# EAGLE design manuellsteuerung (EAGLE 6.4)
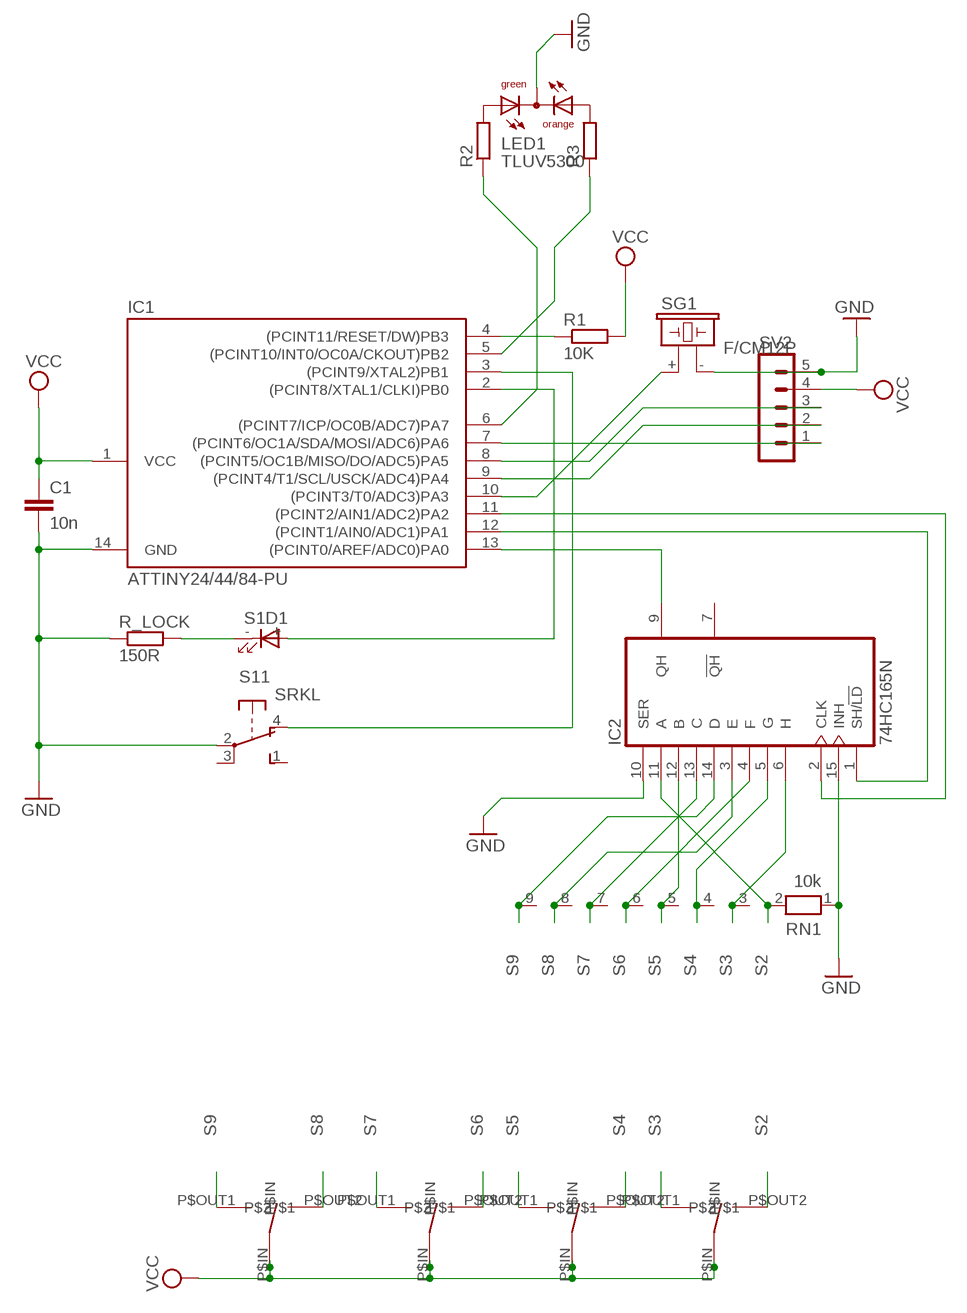
[diagram p0: schematic, sheet 1]

## Parts
C1  10n  C-EU025-024X044  [C025-024X044]
IC1  ATTINY24/44/84-PU  [DIL14]
IC2  74HC165N  [DIL16]
LED1  TLUV5300  [TLUV5300]
R1  10K  R-EU_0207/7  [0207/7]
R2  R-EU_0207/7  [0207/7]
R3  R-EU_0207/7  [0207/7]
R_LOCK  150R  R-EU_0207/10  [0207/10]
RN1  10k  RN08  [RN-9]
S1  SRKL  [SRKL]
SG1  F/CM12P  [F/CM12P]
SV2  MA05-1  [MA05-1]
U$1  MS_500E  [MS_500E]
U$2  MS_500E  [MS_500E]
U$3  MS_500E  [MS_500E]
U$4  MS_500E  [MS_500E]

## Nets
GND: C1.2 IC1.14(GND) IC2.10(SER) IC2.15(INH) LED1.CC R_LOCK.1 RN1.1 S1.2(1:P) SG1.- SV2.5
MISO: IC1.8((PCINT5/OC1B/MISO/DO/ADC5)PA5) SV2.3
MOSI: IC1.7((PCINT6/OC1A/SDA/MOSI/ADC6)PA6) SV2.1
N$1: IC1.13((PCINT0/AREF/ADC0)PA0) IC2.9(QH)
N$2: IC1.12((PCINT1/AIN0/ADC1)PA1) IC2.1(SH/!LD)
N$3: IC1.11((PCINT2/AIN1/ADC2)PA2) IC2.2(CLK)
N$4: R_LOCK.2 S1.-(D1:C)
N$5: IC1.2((PCINT8/XTAL1/CLKI)PB0) S1.+(D1:A)
N$6: IC1.3((PCINT9/XTAL2)PB1) S1.4(1:O)
N$7: IC1.10((PCINT3/T0/ADC3)PA3) SG1.+
N$11: LED1.AG R2.2
N$12: LED1.AO R3.2
N$13: IC1.6((PCINT7/ICP/OC0B/ADC7)PA7) R2.1
N$14: IC1.5((PCINT10/INT0/OC0A/CKOUT)PB2) R3.1
RESET: IC1.4((PCINT11/RESET/DW)PB3) R1.1
S2: IC2.11(A) RN1.2 U$4.P$OUT2
S3: IC2.6(H) RN1.3 U$4.P$OUT1
S4: IC2.5(G) RN1.4 U$1.P$OUT2
S5: IC2.12(B) RN1.5 U$1.P$OUT1
S6: IC2.4(F) RN1.6 U$3.P$OUT2
S7: IC2.13(C) RN1.7 U$3.P$OUT1
S8: IC2.3(E) RN1.8 U$2.P$OUT2
S9: IC2.14(D) RN1.9 U$2.P$OUT1
SCK: IC1.9((PCINT4/T1/SCL/USCK/ADC4)PA4) SV2.2
VCC: C1.1 IC1.1(VCC) R1.2 SV2.4 U$1.P$IN U$2.P$IN U$3.P$IN U$4.P$IN
Unconnected: IC2.7(!QH) S1.1(1:S) S1.3(1:P)

## Power pins joined to a net without a drawn wire
GND: IC2.8(GND)
VCC: IC2.16(VCC)

## Library data of the parts
C1 = resistor:C-EU: CAPACITOR, European symbol
IC1 = attiny24_44_84:ATTINY24/44/84
IC2 = 74xx-eu:74*165: 8-bit parallel load SHIFT REGISTER
LED1 = led:TLUV5300: Bicolor LED 5 mm Untinted Diffused Package Source: www.vishay.com .. Bi-Color LED Vashay TLUV5300.pdf
R1-R3 R_LOCK = resistor:R-EU_: RESISTOR, European symbol
RN1 = resistor-net:RN08: RESISTOR NETWORK; OC_FARNELL: unknown; OC_NEWARK: unknown
S1 = switch-misc:SRKL: SWITCH
SG1 = buzzer:F/CM12P: BUZZER Source: Buerklin; OC_FARNELL: unknown; OC_NEWARK: unknown
SV2 = con-lstb:MA05-1: PIN HEADER; OC_FARNELL: unknown; OC_NEWARK: unknown
U$1-U$4 = n39:MS_500E: MS 500E :: Kippschalter 1-polig, 6A-125VAC, (Ein)-Aus-(Ein) http://www.reichelt.de/index.html?ARTICLE=13158

## Board
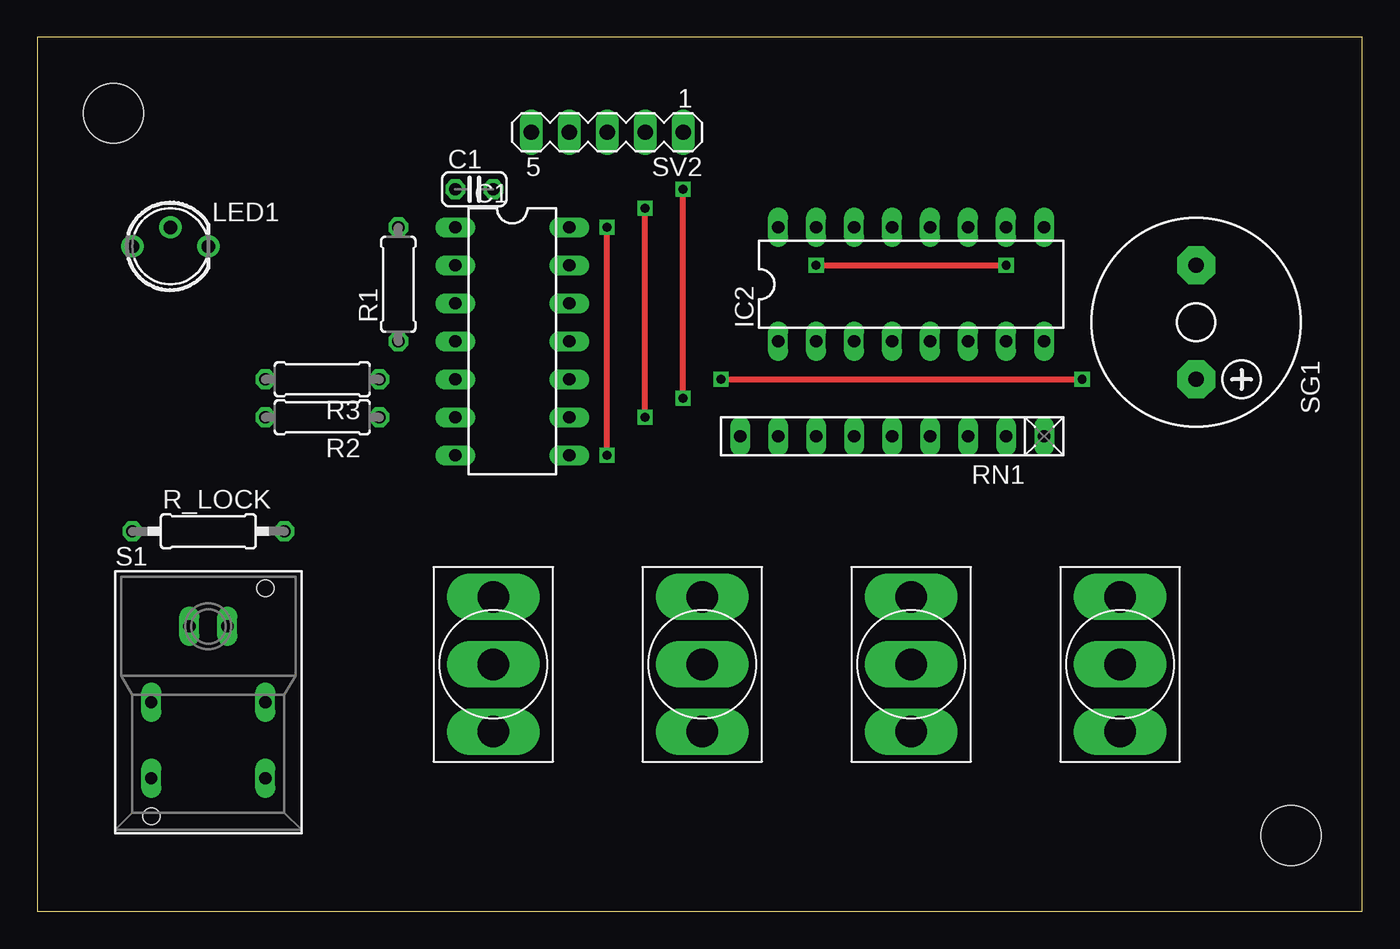
[diagram p1: board, top side]
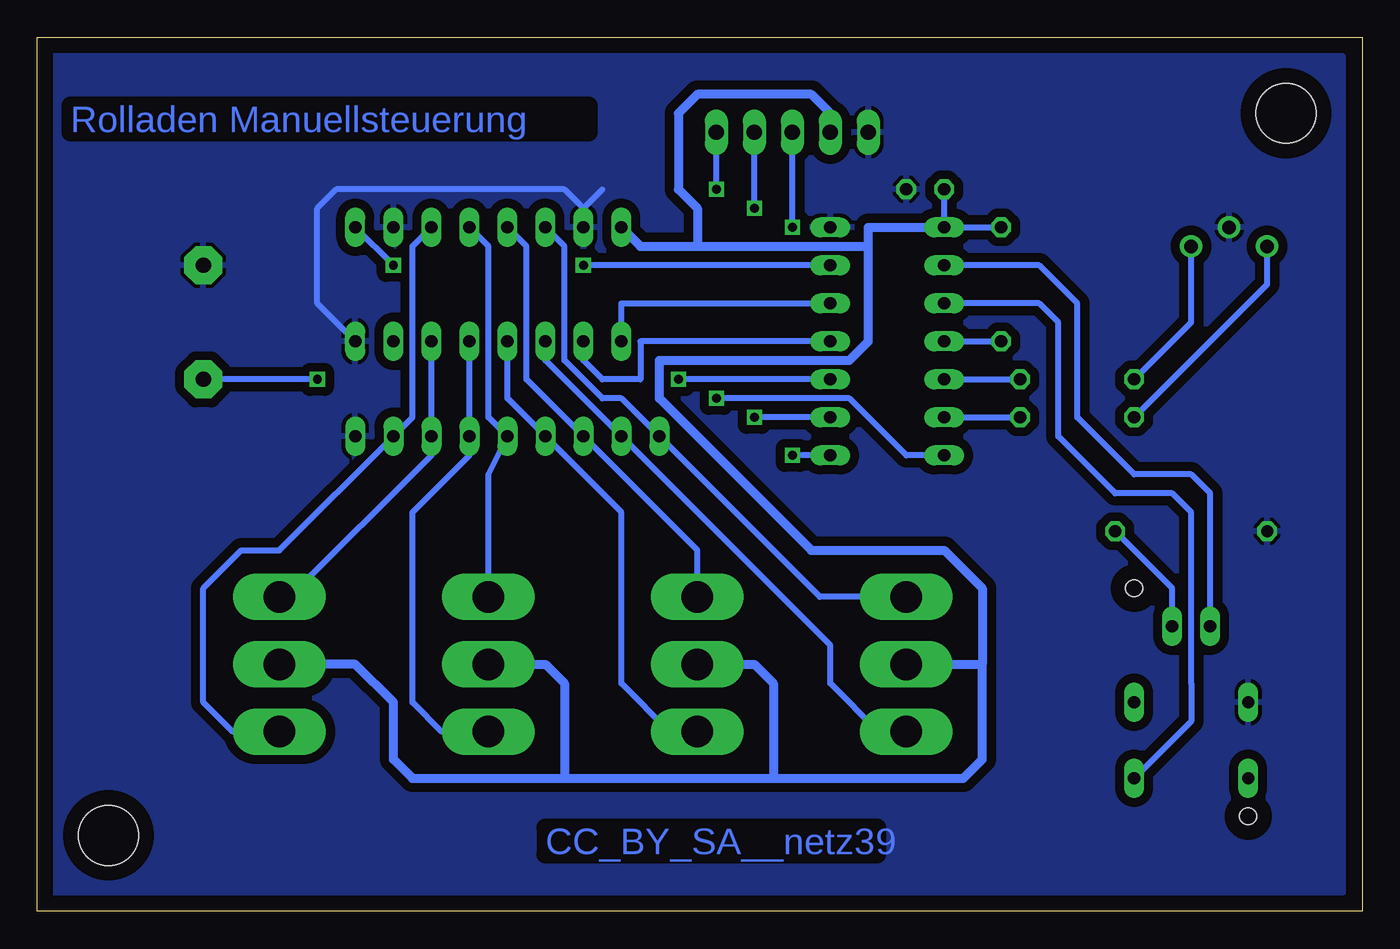
[diagram p2: board, bottom side, seen from below]

Size 88.57 x 58.41 mm. Coordinates in mm from the lower left corner, seen from the top.
Outline: 0,0 88.57,0 88.57,58.41 0,58.41 0,0
Copper layers (1*16): Top 0.035mm / dielectric 1.5mm / Bottom 0.035mm
Design rules "default *": minimum track width 10mil, minimum drill 24mil, track to track 10mil, track to pad 10mil, pad to pad 10mil, via to via 10mil, smd to smd 8mil, copper to edge 40mil, drill to drill 8mil, minimum pad ring 10mil, minimum via ring 8mil, stop-mask expansion 4mil, vias tented up to drill 0mil, thermal gap 10mil
Holes 4 mm at 5.08,53.34 83.82,5.08

### Footprints (pad centres in the part's own frame; a part is rotated, then mirrored left to right if it is on the bottom)
C025-024X044 = drill 0.813 octagon: 1 -1.27,0; 2 1.27,0
DIL14 = drill 0.813 long: 1 -7.62,-3.81; 2 -5.08,-3.81; 3 -2.54,-3.81; 4 0,-3.81; 5 2.54,-3.81; 6 5.08,-3.81; 7 7.62,-3.81; 8 7.62,3.81; 9 5.08,3.81; 10 2.54,3.81; 11 0,3.81; 12 -2.54,3.81; 13 -5.08,3.81; 14 -7.62,3.81
DIL16 = drill 0.813 long: 1 -8.89,-3.81; 2 -6.35,-3.81; 3 -3.81,-3.81; 4 -1.27,-3.81; 5 1.27,-3.81; 6 3.81,-3.81; 7 6.35,-3.81; 8 8.89,-3.81; 9 8.89,3.81; 10 6.35,3.81; 11 3.81,3.81; 12 1.27,3.81; 13 -1.27,3.81; 14 -3.81,3.81; 15 -6.35,3.81; 16 -8.89,3.81
TLUV5300 = drill 0.9 pad 1.5: AG 2.54,0; AO -2.54,0; CC 0,-1.27
0207/7 = drill 0.813 octagon: 1 -3.81,0; 2 3.81,0
0207/10 = drill 0.813 octagon: 1 -5.08,0; 2 5.08,0
RN-9 = drill 0.813 long: 1 -10.16,0; 2 -7.62,0; 3 -5.08,0; 4 -2.54,0; 5 0,0; 6 2.54,0; 7 5.08,0; 8 7.62,0; 9 10.16,0
SRKL = drill 0.813 long: 1 -3.81,-5.08; 2 -3.81,0; 3 3.81,0; 4 3.81,-5.08; + -1.27,5.08; - 1.27,5.08 | hole 1.118: 3.81,7.62; -3.81,-7.62
F/CM12P = drill 1.016 pad 2.54 octagon: + 3.81,0; - -3.81,0
MA05-1 = drill 1.016 long: 1 -5.08,0; 2 -2.54,0; 3 0,0; 4 2.54,0; 5 5.08,0
MS_500E = drill 2.1 long: P$IN 0,0; P$OUT1 0,4.5; P$OUT2 0,-4.5

### Placement (x,y rotation side)
C1  29.21,48.26 0 top
IC1  31.75,38.1 270 top
IC2  58.42,41.91 0 top
LED1  8.89,44.45 180 top
R1  24.13,41.91 90 top
R2  19.05,33.02 180 top
R3  19.05,35.56 180 top
R_LOCK  11.43,25.4 0 top
RN1  57.15,31.75 180 top
S1  11.43,13.97 0 top
SG1  77.47,39.37 270 top
SV2  38.1,52.07 180 top
U$1  58.42,16.51 0 top
U$2  30.48,16.51 0 top
U$3  44.45,16.51 0 top
U$4  72.39,16.51 0 top

### Tracks (layer width: path | path; a pad name or v marks a point on that pad's centre or on a via)
GND
  Bottom 0.406: IC2.8 69.85,40.64 69.85,46.99 68.58,48.26 53.34,48.26 52.07,46.99 | IC2.15 52.07,46.99 | 52.07,46.99 50.8,48.26
  pour Bottom (isolate 0.61): 1.27,57.15 87.63,57.15 87.63,1.27 1.27,1.27
MISO  (via drill 0.6)
  Top 0.406: v38.1,30.48 v38.1,45.72
  Bottom 0.406: IC1.8 v38.1,30.48 | v38.1,45.72 SV2.3
MOSI  (via drill 0.6)
  Top 0.406: v43.18,34.29 v43.18,48.26
  Bottom 0.406: IC1.7 30.48,30.48 34.29,34.29 v43.18,34.29 | v43.18,48.26 SV2.1
N$1  (via drill 0.6)
  Top 0.406: v52.07,43.18 v64.77,43.18
  Bottom 0.406: IC1.13 v52.07,43.18 | v64.77,43.18 IC2.9
N$2
  Bottom 0.406: IC2.1 49.53,40.64 IC1.12
N$3
  Bottom 0.406: IC2.2 52.07,36.83 50.8,35.56 48.26,35.56 48.26,38.1 IC1.11
N$4
  Bottom 0.406: S1.- 12.7,21.59 R_LOCK.2
N$5
  Bottom 0.406: S1.+ 10.16,27.94 11.43,29.21 15.24,29.21 19.05,33.02 19.05,40.64 21.59,43.18 IC1.2
N$6
  Bottom 0.406: IC1.3 21.59,40.64 20.32,39.37 20.32,31.75 16.51,27.94 12.7,27.94 11.43,26.67 11.43,15.24 11.43,12.7 S1.4
N$7  (via drill 0.6)
  Top 0.406: v45.72,35.56 v69.85,35.56
  Bottom 0.406: IC1.10 v45.72,35.56 | v69.85,35.56 SG1.+
N$8  (via drill 0.6)
  other vias: 45.72,35.56
N$9  (via drill 0.6)
  other vias: 69.85,35.56
N$10  (via drill 0.6)
  other vias: 64.77,43.18
N$11
  Bottom 0.406: R2.2 6.35,41.91 LED1.AG
N$12
  Bottom 0.406: R3.2 11.43,39.37 LED1.AO
N$13
  Bottom 0.406: IC1.6 R2.1
N$14
  Bottom 0.406: IC1.5 R3.1
N$16  (via drill 0.6)
  other vias: 52.07,43.18
N$18  (via drill 0.6)
  other vias: 43.18,34.29
RESET
  Bottom 0.406: IC1.4 R1.1
S2
  Bottom 0.406: IC2.11 63.5,44.45 63.5,33.02 RN1.2 72.39,24.13 74.93,24.13 77.47,21.59 77.47,13.97 75.51,12.01 U$4.P$OUT2
S3
  Bottom 0.406: IC2.6 RN1.3 62.23,30.48 71.7,21.01 U$4.P$OUT1
S4
  Bottom 0.406: IC2.5 RN1.4 59.69,30.48 63.5,26.67 63.5,13.97 61.54,12.01 U$1.P$OUT2
S5
  Bottom 0.406: IC2.12 58.42,44.45 58.42,33.02 RN1.5 58.42,29.21 U$1.P$OUT1
S6
  Bottom 0.406: IC2.4 57.15,34.29 RN1.6 49.53,26.67 49.53,15.24 46.3,12.01 U$3.P$OUT2
S7
  Bottom 0.406: IC2.13 55.88,44.45 55.88,35.56 RN1.7 44.45,24.13 U$3.P$OUT1
S8
  Bottom 0.406: IC2.3 54.61,36.83 RN1.8 35.56,17.78 35.56,15.24 32.33,12.01 U$2.P$OUT2
S9
  Bottom 0.406: IC2.14 53.34,44.45 53.34,36.83 50.8,34.29 49.53,34.29 RN1.9 36.25,21.01 U$2.P$OUT1
SCK  (via drill 0.6)
  Top 0.406: v40.64,33.02 v40.64,46.99
  Bottom 0.406: IC1.9 v40.64,33.02 | v40.64,46.99 SV2.2
VCC
  Bottom 0.406: C1.1 IC1.1 R1.2
  Bottom 0.61: IC1.1 33.02,45.72 33.02,44.45 | U$3.P$IN 40.64,16.51 39.37,15.24 39.37,8.89 | 39.37,8.89 26.67,8.89 25.4,10.16 25.4,16.51 | U$1.P$IN 54.61,16.51 53.34,15.24 53.34,8.89 | 53.34,8.89 39.37,8.89 | 53.34,8.89 63.5,8.89 64.77,10.16 64.77,13.97 67.31,16.51 U$4.P$IN | U$2.P$IN 25.4,16.51 | IC2.16 48.26,44.45 44.45,44.45 | 44.45,44.45 33.02,44.45 | 33.02,44.45 33.02,38.1 34.29,36.83 46.99,36.83 46.99,34.29 36.83,24.13 27.94,24.13 25.4,21.59 25.4,16.51 | SV2.4 35.56,53.34 36.83,54.61 44.45,54.61 45.72,53.34 45.72,48.26 44.45,46.99 44.45,44.45

### Text on the board
Bottom: Rolladen Manuellsteuerung | CC_BY_SA__netz39